# Altium schematic sheet 17 USB 3.0.SchDoc
size C; DocumentNumber: 17; SheetNumber: 17; SheetTotal: 17; PageSetup: Record=PageOptions|CenterHorizontal=True|CenterVertical=True|PrintScale=0.70|XCorrection=1.00|YCorrection=1.00|PrintKind=1|BorderSize=5000000|LeftOffset=0|BottomOffset=0|Orientation=2|PaperLength=1000|PaperWidth=1000|Scale=100|PaperSource=7|PrintQuality=600|MediaType=1|DitherType=10|PrintScaleMode=1|PaperKind=11x17|PaperIndex=17
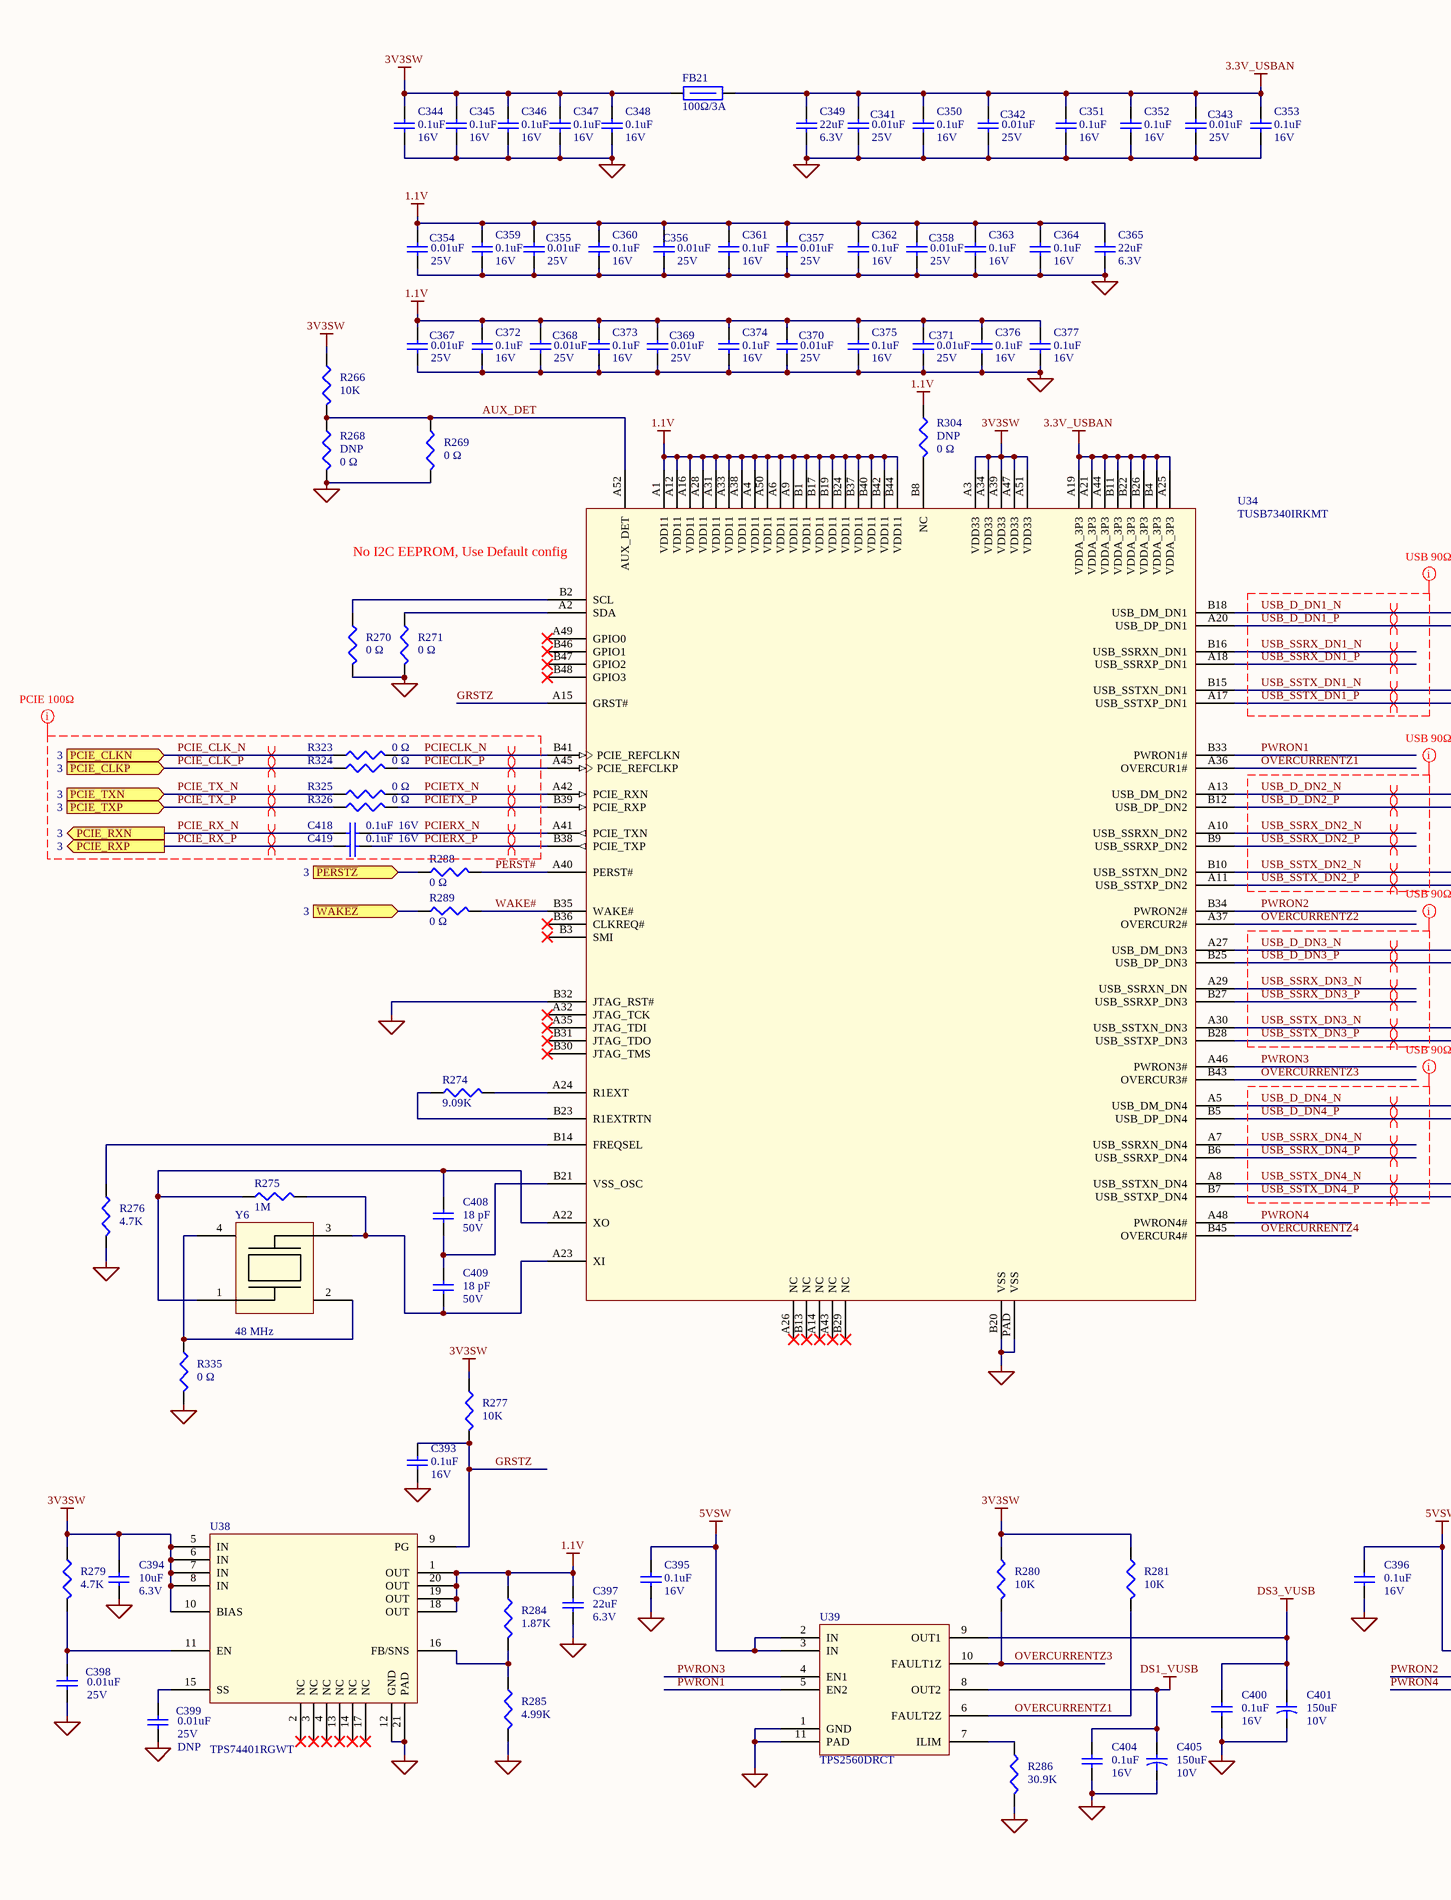
[diagram p0: 17 USB 3.0.SchDoc, left]
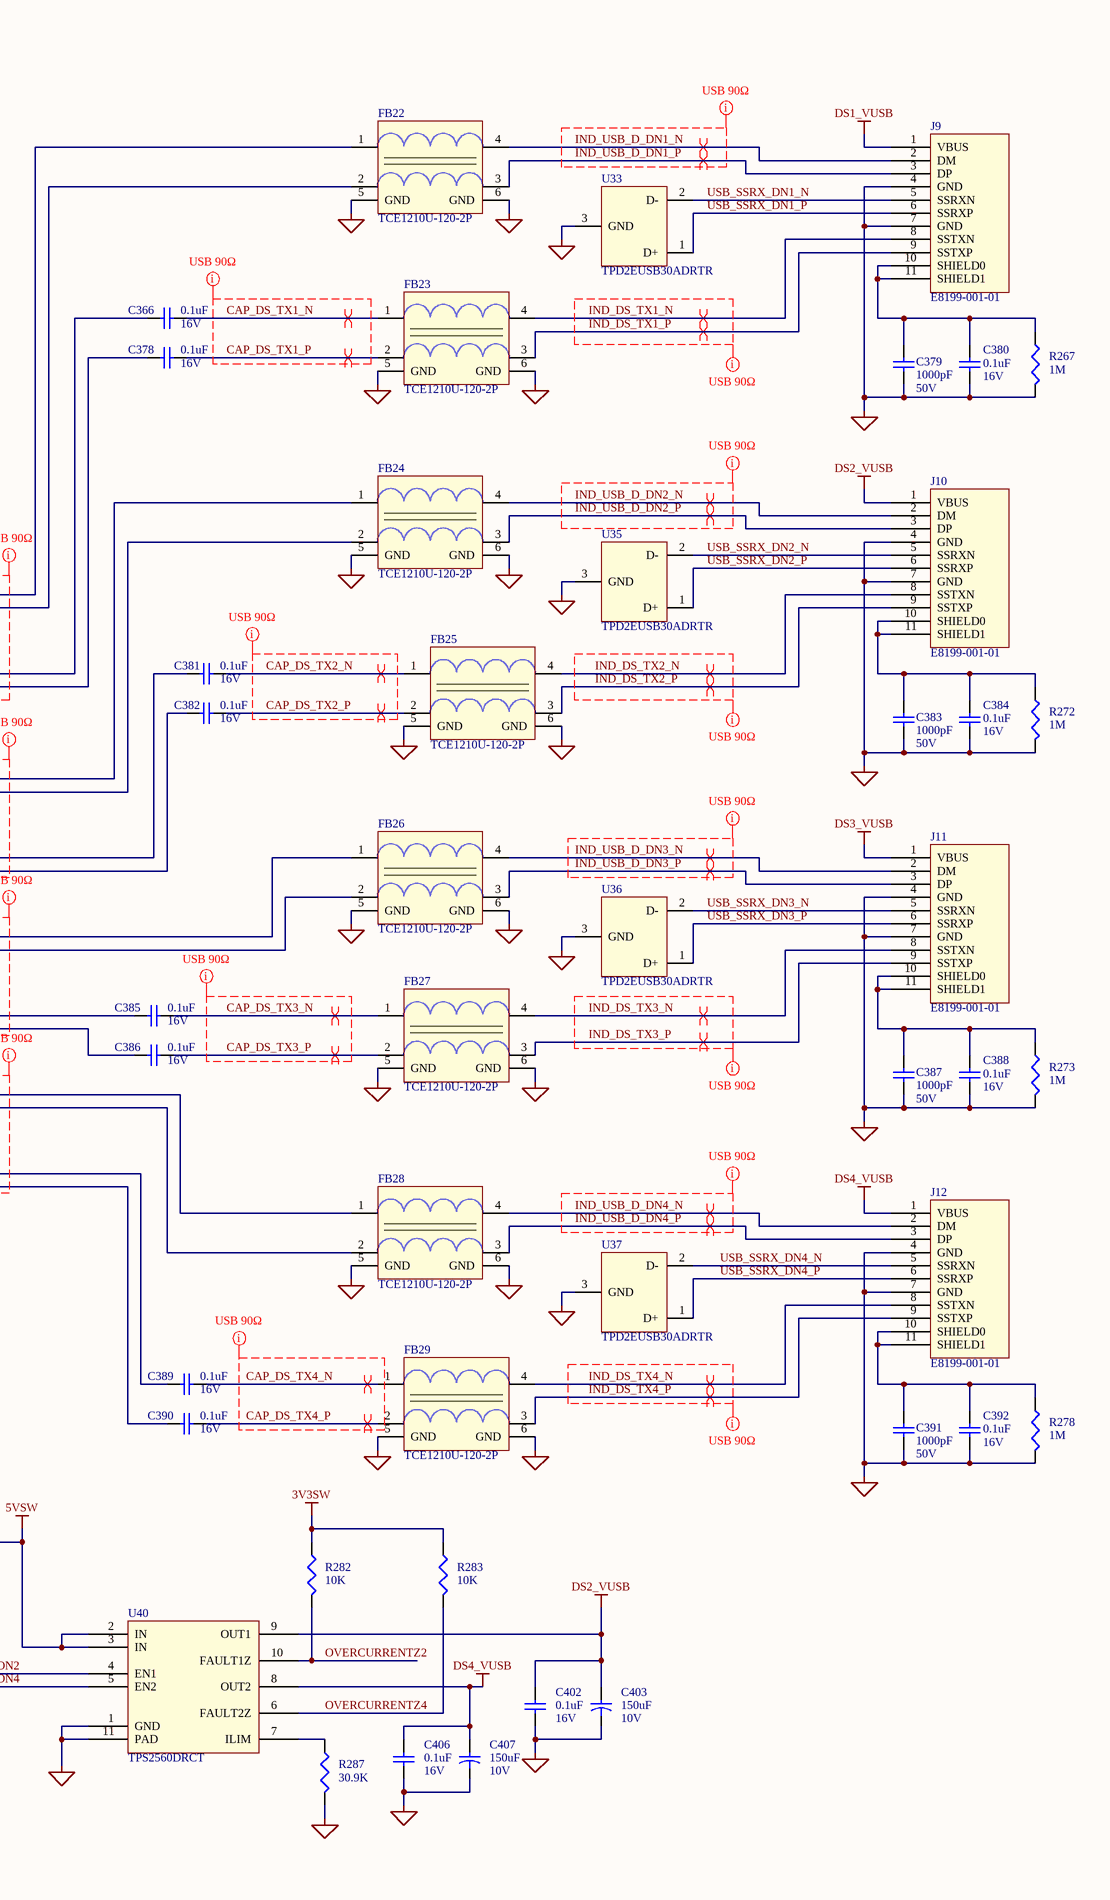
[diagram p1: 17 USB 3.0.SchDoc, right]

## Parts
C341  value 0.01uF  Voltage: 25V  [CAP_0402]  (hidden comment: Cap 0.01uF 50V 0402)
C342  value 0.01uF  Voltage: 25V  [CAP_0402]  (hidden comment: Cap 0.01uF 50V 0402)
C343  value 0.01uF  Voltage: 25V  [CAP_0402]  (hidden comment: Cap 0.01uF 50V 0402)
C344  value 0.1uF  Voltage: 16V  [CAP_0402]  (hidden comment: Cap 0.1uF 16V 0402)
C345  value 0.1uF  Voltage: 16V  [CAP_0402]  (hidden comment: Cap 0.1uF 16V 0402)
C346  value 0.1uF  Voltage: 16V  [CAP_0402]  (hidden comment: Cap 0.1uF 16V 0402)
C347  value 0.1uF  Voltage: 16V  [CAP_0402]  (hidden comment: Cap 0.1uF 16V 0402)
C348  value 0.1uF  Voltage: 16V  [CAP_0402]  (hidden comment: Cap 0.1uF 16V 0402)
C349  value 22uF  Voltage: 6.3V  [CAP_0603]  (hidden comment: Cap 22uF 6.3V 0603)
C350  value 0.1uF  Voltage: 16V  [CAP_0402]  (hidden comment: Cap 0.1uF 16V 0402)
C351  value 0.1uF  Voltage: 16V  [CAP_0402]  (hidden comment: Cap 0.1uF 16V 0402)
C352  value 0.1uF  Voltage: 16V  [CAP_0402]  (hidden comment: Cap 0.1uF 16V 0402)
C353  value 0.1uF  Voltage: 16V  [CAP_0402]  (hidden comment: Cap 0.1uF 16V 0402)
C354  value 0.01uF  Voltage: 25V  [CAP_0402]  (hidden comment: Cap 0.01uF 50V 0402)
C355  value 0.01uF  Voltage: 25V  [CAP_0402]  (hidden comment: Cap 0.01uF 50V 0402)
C356  value 0.01uF  Voltage: 25V  [CAP_0402]  (hidden comment: Cap 0.01uF 50V 0402)
C357  value 0.01uF  Voltage: 25V  [CAP_0402]  (hidden comment: Cap 0.01uF 50V 0402)
C358  value 0.01uF  Voltage: 25V  [CAP_0402]  (hidden comment: Cap 0.01uF 50V 0402)
C359  value 0.1uF  Voltage: 16V  [CAP_0402]  (hidden comment: Cap 0.1uF 16V 0402)
C360  value 0.1uF  Voltage: 16V  [CAP_0402]  (hidden comment: Cap 0.1uF 16V 0402)
C361  value 0.1uF  Voltage: 16V  [CAP_0402]  (hidden comment: Cap 0.1uF 16V 0402)
C362  value 0.1uF  Voltage: 16V  [CAP_0402]  (hidden comment: Cap 0.1uF 16V 0402)
C363  value 0.1uF  Voltage: 16V  [CAP_0402]  (hidden comment: Cap 0.1uF 16V 0402)
C364  value 0.1uF  Voltage: 16V  [CAP_0402]  (hidden comment: Cap 0.1uF 16V 0402)
C365  value 22uF  Voltage: 6.3V  [CAP_0603]  (hidden comment: Cap 22uF 6.3V 0603)
C366  value 0.1uF  Voltage: 16V  [CAP_0402]  (hidden comment: Cap 0.1uF 16V 0402)
C367  value 0.01uF  Voltage: 25V  [CAP_0402]  (hidden comment: Cap 0.01uF 50V 0402)
C368  value 0.01uF  Voltage: 25V  [CAP_0402]  (hidden comment: Cap 0.01uF 50V 0402)
C369  value 0.01uF  Voltage: 25V  [CAP_0402]  (hidden comment: Cap 0.01uF 50V 0402)
C370  value 0.01uF  Voltage: 25V  [CAP_0402]  (hidden comment: Cap 0.01uF 50V 0402)
C371  value 0.01uF  Voltage: 25V  [CAP_0402]  (hidden comment: Cap 0.01uF 50V 0402)
C372  value 0.1uF  Voltage: 16V  [CAP_0402]  (hidden comment: Cap 0.1uF 16V 0402)
C373  value 0.1uF  Voltage: 16V  [CAP_0402]  (hidden comment: Cap 0.1uF 16V 0402)
C374  value 0.1uF  Voltage: 16V  [CAP_0402]  (hidden comment: Cap 0.1uF 16V 0402)
C375  value 0.1uF  Voltage: 16V  [CAP_0402]  (hidden comment: Cap 0.1uF 16V 0402)
C376  value 0.1uF  Voltage: 16V  [CAP_0402]  (hidden comment: Cap 0.1uF 16V 0402)
C377  value 0.1uF  Voltage: 16V  [CAP_0402]  (hidden comment: Cap 0.1uF 16V 0402)
C378  value 0.1uF  Voltage: 16V  [CAP_0402]  (hidden comment: Cap 0.1uF 16V 0402)
C379  value 1000pF  Voltage: 50V  [CAP_0402]  (hidden comment: Cap 1000pF 50V 0402)
C380  value 0.1uF  Voltage: 16V  [CAP_0402]  (hidden comment: Cap 0.1uF 16V 0402)
C381  value 0.1uF  Voltage: 16V  [CAP_0402]  (hidden comment: Cap 0.1uF 16V 0402)
C382  value 0.1uF  Voltage: 16V  [CAP_0402]  (hidden comment: Cap 0.1uF 16V 0402)
C383  value 1000pF  Voltage: 50V  [CAP_0402]  (hidden comment: Cap 1000pF 50V 0402)
C384  value 0.1uF  Voltage: 16V  [CAP_0402]  (hidden comment: Cap 0.1uF 16V 0402)
C385  value 0.1uF  Voltage: 16V  [CAP_0402]  (hidden comment: Cap 0.1uF 16V 0402)
C386  value 0.1uF  Voltage: 16V  [CAP_0402]  (hidden comment: Cap 0.1uF 16V 0402)
C387  value 1000pF  Voltage: 50V  [CAP_0402]  (hidden comment: Cap 1000pF 50V 0402)
C388  value 0.1uF  Voltage: 16V  [CAP_0402]  (hidden comment: Cap 0.1uF 16V 0402)
C389  value 0.1uF  Voltage: 16V  [CAP_0402]  (hidden comment: Cap 0.1uF 16V 0402)
C390  value 0.1uF  Voltage: 16V  [CAP_0402]  (hidden comment: Cap 0.1uF 16V 0402)
C391  value 1000pF  Voltage: 50V  [CAP_0402]  (hidden comment: Cap 1000pF 50V 0402)
C392  value 0.1uF  Voltage: 16V  [CAP_0402]  (hidden comment: Cap 0.1uF 16V 0402)
C393  value 0.1uF  Voltage: 16V  [CAP_0402]  (hidden comment: Cap 0.1uF 16V 0402)
C394  value 10uF  Voltage: 6.3V  [CAP_0402]  (hidden comment: Cap 10uF 6.3V 0402)
C395  value 0.1uF  Voltage: 16V  [CAP_0402]  (hidden comment: Cap 0.1uF 16V 0402)
C396  value 0.1uF  Voltage: 16V  [CAP_0402]  (hidden comment: Cap 0.1uF 16V 0402)
C397  value 22uF  Voltage: 6.3V  [CAP_0603]  (hidden comment: Cap 22uF 6.3V 0603)
C398  value 0.01uF  Voltage: 25V  [CAP_0402]  (hidden comment: Cap 0.01uF 50V 0402)
C399  value 0.01uF  Voltage: 25V  [CAP_0402]  (hidden comment: Cap 0.01uF 50V 0402)
C400  value 0.1uF  Voltage: 16V  [CAP_0402]  (hidden comment: Cap 0.1uF 16V 0402)
C401  value 150uF  Voltage: 10V  [SMD(6.6x6.6x5.8)_WT1A151MCL1GS]  (hidden comment: Cap 150uF 10V)
C402  value 0.1uF  Voltage: 16V  [CAP_0402]  (hidden comment: Cap 0.1uF 16V 0402)
C403  value 150uF  Voltage: 10V  [SMD(6.6x6.6x5.8)_WT1A151MCL1GS]  (hidden comment: Cap 150uF 10V)
C404  value 0.1uF  Voltage: 16V  [CAP_0402]  (hidden comment: Cap 0.1uF 16V 0402)
C405  value 150uF  Voltage: 10V  [SMD(6.6x6.6x5.8)_WT1A151MCL1GS]  (hidden comment: Cap 150uF 10V)
C406  value 0.1uF  Voltage: 16V  [CAP_0402]  (hidden comment: Cap 0.1uF 16V 0402)
C407  value 150uF  Voltage: 10V  [SMD(6.6x6.6x5.8)_WT1A151MCL1GS]  (hidden comment: Cap 150uF 10V)
C408  value 18 pF  Voltage: 50V  [CAP_0402]  (hidden comment: Cap 18pF 50V 0402)
C409  value 18 pF  Voltage: 50V  [CAP_0402]  (hidden comment: Cap 18pF 50V 0402)
C418  value 0.1uF  Voltage: 16V  [CAP_0402]  (hidden comment: Cap 0.1uF 16V 0402)
C419  value 0.1uF  Voltage: 16V  [CAP_0402]  (hidden comment: Cap 0.1uF 16V 0402)
FB21  value 100Ω/3A  [IND_0603]  (hidden comment: BLM18KG101TN1D)
FB22  TCE1210U-120-2P  [USB_TCE1210U-120-2P]
FB23  TCE1210U-120-2P  [USB_TCE1210U-120-2P]
FB24  TCE1210U-120-2P  [USB_TCE1210U-120-2P]
FB25  TCE1210U-120-2P  [USB_TCE1210U-120-2P]
FB26  TCE1210U-120-2P  [USB_TCE1210U-120-2P]
FB27  TCE1210U-120-2P  [USB_TCE1210U-120-2P]
FB28  TCE1210U-120-2P  [USB_TCE1210U-120-2P]
FB29  TCE1210U-120-2P  [USB_TCE1210U-120-2P]
J9  E8199-001-01  [USB_E8199-001-01]
J10  E8199-001-01  [USB_E8199-001-01]
J11  E8199-001-01  [USB_E8199-001-01]
J12  E8199-001-01  [USB_E8199-001-01]
R266  value 10K  [RES_0402]  (hidden comment: Res 10K 0.063W)
R267  value 1M  [RES_0402]  (hidden comment: Res 1M 0.063W)
R268  value 0 Ω  [RES_0402]  (hidden comment: Res 0 ohm 0.1W DNP)
R269  value 0 Ω  [RES_0402]  (hidden comment: Res 0 ohm 0.1W)
R270  value 0 Ω  [RES_0402]  (hidden comment: Res 0 ohm 0.1W)
R271  value 0 Ω  [RES_0402]  (hidden comment: Res 0 ohm 0.1W)
R272  value 1M  [RES_0402]  (hidden comment: Res 1M 0.063W)
R273  value 1M  [RES_0402]  (hidden comment: Res 1M 0.063W)
R274  value 9.09K  [RES_0402]  (hidden comment: Res 9.09K 0.063W)
R275  value 1M  [RES_0402]  (hidden comment: Res 1M 0.063W)
R276  value 4.7K  [RES_0402]  (hidden comment: Res 4.7K 0.063W)
R277  value 10K  [RES_0402]  (hidden comment: Res 10K 0.063W)
R278  value 1M  [RES_0402]  (hidden comment: Res 1M 0.063W)
R279  value 4.7K  [RES_0402]  (hidden comment: Res 4.7K 0.063W)
R280  value 10K  [RES_0402]  (hidden comment: Res 10K 0.063W)
R281  value 10K  [RES_0402]  (hidden comment: Res 10K 0.063W)
R282  value 10K  [RES_0402]  (hidden comment: Res 10K 0.063W)
R283  value 10K  [RES_0402]  (hidden comment: Res 10K 0.063W)
R284  value 1.87K  [RES_0402]  (hidden comment: Res 1.87K 0.063W)
R285  value 4.99K  [RES_0402]  (hidden comment: Res 4.99K 0.063W)
R286  value 30.9K  [RES_0402]  (hidden comment: Res 30.9K 0.063W)
R287  value 30.9K  [RES_0402]  (hidden comment: Res 30.9K 0.063W)
R288  value 0 Ω  [RES_0402]  (hidden comment: Res 0 ohm 0.1W)
R289  value 0 Ω  [RES_0402]  (hidden comment: Res 0 ohm 0.1W)
R304  value 0 Ω  [RES_0402]  (hidden comment: Res 0 ohm 0.1W DNP)
R323  value 0 Ω  [RES_0402]  (hidden comment: Res 0 ohm 0.1W)
R324  value 0 Ω  [RES_0402]  (hidden comment: Res 0 ohm 0.1W)
R325  value 0 Ω  [RES_0402]  (hidden comment: Res 0 ohm 0.1W)
R326  value 0 Ω  [RES_0402]  (hidden comment: Res 0 ohm 0.1W)
R335  value 0 Ω  [RES_0402]  (hidden comment: Res 0 ohm 0.1W)
U33  TPD2EUSB30ADRTR  [SOT-3_TPD2EUSB30ADRTR]
U34  TUSB7340IRKMT  [WQFN-100_TUSB7340]
U35  TPD2EUSB30ADRTR  [SOT-3_TPD2EUSB30ADRTR]
U36  TPD2EUSB30ADRTR  [SOT-3_TPD2EUSB30ADRTR]
U37  TPD2EUSB30ADRTR  [SOT-3_TPD2EUSB30ADRTR]
U38  TPS74401RGWT  [VQFN-20_TPS74401RGWT]
U39  TPS2560DRCT  [VSON-10_TPS2560DRCT]
U40  TPS2560DRCT  [VSON-10_TPS2560DRCT]
Y6  value 48 MHz  [SMD(5x3.2)_ABM3B-48.000MHZ-B2-T]  (hidden comment: ABM3B-48.000MHZ-B2-T)

## Ports
PCIE_CLKN (in, see 3), PCIE_CLKP (in, see 3), PCIE_RXN (out, see 3), PCIE_RXP (out, see 3), PCIE_TXN (in, see 3), PCIE_TXP (in, see 3), ~{PERSTZ} (in, see 3), ~{WAKEZ} (in, see 3)

## Nets
1.1V: C354.1 C355.1 C356.1 C357.1 C358.1 C359.1 C360.1 C361.1 C362.1 C363.1 C364.1 C365.1 C367.1 C368.1 C369.1 C370.1 C371.1 C372.1 C373.1 C374.1 C375.1 C376.1 C377.1 C397.1 R284.1 R304.1 U34.A1(VDD11) U34.A4(VDD11) U34.A6(VDD11) U34.A9(VDD11) U34.A12(VDD11) U34.A16(VDD11) U34.A28(VDD11) U34.A31(VDD11) U34.A33(VDD11) U34.A38(VDD11) U34.A50(VDD11) U34.B1(VDD11) U34.B17(VDD11) U34.B19(VDD11) U34.B24(VDD11) U34.B37(VDD11) U34.B40(VDD11) U34.B42(VDD11) U34.B44(VDD11) U38.1(OUT) U38.18(OUT) U38.19(OUT) U38.20(OUT)
3.3V_USBAN: C341.1 C342.1 C343.1 C349.1 C350.1 C351.1 C352.1 C353.1 FB21.2 U34.A19(VDDA_3P3) U34.A21(VDDA_3P3) U34.A25(VDDA_3P3) U34.A44(VDDA_3P3) U34.B4(VDDA_3P3) U34.B11(VDDA_3P3) U34.B22(VDDA_3P3) U34.B26(VDDA_3P3)
3V3SW: C344.1 C345.1 C346.1 C347.1 C348.1 C394.1 FB21.1 R266.1 R277.1 R279.1 R280.1 R281.1 R282.1 R283.1 U34.A3(VDD33) U34.A34(VDD33) U34.A39(VDD33) U34.A47(VDD33) U34.A51(VDD33) U38.5(IN) U38.6(IN) U38.7(IN) U38.8(IN) U38.10(BIAS)
5VSW: C395.1 C396.2 U39.2(IN) U39.3(IN) U40.2(IN) U40.3(IN)
DS1_VUSB: C404.1 C405.1 J9.1(VBUS) U39.8(OUT2)
DS2_VUSB: C402.1 C403.1 J10.1(VBUS) U40.9(OUT1)
DS3_VUSB: C400.1 C401.1 J11.1(VBUS) U39.9(OUT1)
DS4_VUSB: C406.1 C407.1 J12.1(VBUS) U40.8(OUT2)
GND: C341.2 C342.2 C343.2 C344.2 C345.2 C346.2 C347.2 C348.2 C349.2 C350.2 C351.2 C352.2 C353.2 C354.2 C355.2 C356.2 C357.2 C358.2 C359.2 C360.2 C361.2 C362.2 C363.2 C364.2 C365.2 C367.2 C368.2 C369.2 C370.2 C371.2 C372.2 C373.2 C374.2 C375.2 C376.2 C377.2 C379.2 C380.2 C383.2 C384.2 C387.2 C388.2 C391.2 C392.2 C393.2 C394.2 C395.2 C396.1 C397.2 C398.2 C399.2 C400.2 C401.2 C402.2 C403.2 C404.2 C405.2 C406.2 C407.2 FB22.5(GND) FB22.6(GND) FB23.5(GND) FB23.6(GND) FB24.5(GND) FB24.6(GND) FB25.5(GND) FB25.6(GND) FB26.5(GND) FB26.6(GND) FB27.5(GND) FB27.6(GND) FB28.5(GND) FB28.6(GND) FB29.5(GND) FB29.6(GND) J9.4(GND) J9.7(GND) J10.4(GND) J10.7(GND) J11.4(GND) J11.7(GND) J12.4(GND) J12.7(GND) R267.2 R268.2 R269.2 R270.2 R271.2 R272.2 R273.2 R276.2 R278.2 R285.2 R286.2 R287.2 R335.2 U33.3(GND) U34.B20(VSS) U34.B32(JTAG_RST#) U34.PAD(VSS) U35.3(GND) U36.3(GND) U37.3(GND) U38.12(GND) U38.21(PAD) U39.1(GND) U39.11(PAD) U40.1(GND) U40.11(PAD)
AUX_DET: R266.2 R268.1 R269.1 U34.A52(AUX_DET)
CAP_DS_TX1_N: C366.2 FB23.1
CAP_DS_TX1_P: C378.2 FB23.2
CAP_DS_TX2_N: C381.2 FB25.1
CAP_DS_TX2_P: C382.2 FB25.2
CAP_DS_TX3_N: C385.2 FB27.1
CAP_DS_TX3_P: C386.2 FB27.2
CAP_DS_TX4_N: C389.2 FB29.1
CAP_DS_TX4_P: C390.2 FB29.2
GRSTZ: C393.1 R277.2 U34.A15(GRST#) U38.9(PG)
IND_DS_TX1_N: FB23.4 J9.8(SSTXN)
IND_DS_TX1_P: FB23.3 J9.9(SSTXP)
IND_DS_TX2_N: FB25.4 J10.8(SSTXN)
IND_DS_TX2_P: FB25.3 J10.9(SSTXP)
IND_DS_TX3_N: FB27.4 J11.8(SSTXN)
IND_DS_TX3_P: FB27.3 J11.9(SSTXP)
IND_DS_TX4_N: FB29.4 J12.8(SSTXN)
IND_DS_TX4_P: FB29.3 J12.9(SSTXP)
IND_USB_D_DN1_N: FB22.4 J9.2(DM)
IND_USB_D_DN1_P: FB22.3 J9.3(DP)
IND_USB_D_DN2_N: FB24.4 J10.2(DM)
IND_USB_D_DN2_P: FB24.3 J10.3(DP)
IND_USB_D_DN3_N: FB26.4 J11.2(DM)
IND_USB_D_DN3_P: FB26.3 J11.3(DP)
IND_USB_D_DN4_N: FB28.4 J12.2(DM)
IND_USB_D_DN4_P: FB28.3 J12.3(DP)
OVERCURRENTZ1: R281.2 U34.A36(OVERCUR1#) U39.6(FAULT2Z)
OVERCURRENTZ2: R282.2 U34.A37(OVERCUR2#) U40.10(FAULT1Z)
OVERCURRENTZ3: R280.2 U34.B43(OVERCUR3#) U39.10(FAULT1Z)
OVERCURRENTZ4: R283.2 U34.B45(OVERCUR4#) U40.6(FAULT2Z)
~{PERSTZ}: R288.1 ; port ~{PERSTZ}
PCIE_CLK_N: R323.1 ; port PCIE_CLKN
PCIE_CLK_P: R324.1 ; port PCIE_CLKP
PCIE_RX_N: C418.1 ; port PCIE_RXN
PCIE_RX_P: C419.1 ; port PCIE_RXP
PCIE_TX_N: R325.1 ; port PCIE_TXN
PCIE_TX_P: R326.1 ; port PCIE_TXP
PCIECLK_N: R323.2 U34.B41(PCIE_REFCLKN)
PCIECLK_P: R324.2 U34.A45(PCIE_REFCLKP)
PCIERX_N: C418.2 U34.A41(PCIE_TXN)
PCIERX_P: C419.2 U34.B38(PCIE_TXP)
PCIETX_N: R325.2 U34.A42(PCIE_RXN)
PCIETX_P: R326.2 U34.B39(PCIE_RXP)
PERST#: R288.2 U34.A40(PERST#)
PWRON1: U34.B33(PWRON1#) U39.5(EN2)
PWRON2: U34.B34(PWRON2#) U40.4(EN1)
PWRON3: U34.A46(PWRON3#) U39.4(EN1)
PWRON4: U34.A48(PWRON4#) U40.5(EN2)
USB_D_DN1_N: FB22.1 U34.B18(USB_DM_DN1)
USB_D_DN1_P: FB22.2 U34.A20(USB_DP_DN1)
USB_D_DN2_N: FB24.1 U34.A13(USB_DM_DN2)
USB_D_DN2_P: FB24.2 U34.B12(USB_DP_DN2)
USB_D_DN3_N: FB26.1 U34.A27(USB_DM_DN3)
USB_D_DN3_P: FB26.2 U34.B25(USB_DP_DN3)
USB_D_DN4_N: FB28.1 U34.A5(USB_DM_DN4)
USB_D_DN4_P: FB28.2 U34.B5(USB_DP_DN4)
USB_SSRX_DN1_N: J9.5(SSRXN) U33.2(D-) U34.B16(USB_SSRXN_DN1)
USB_SSRX_DN1_P: J9.6(SSRXP) U33.1(D+) U34.A18(USB_SSRXP_DN1)
USB_SSRX_DN2_N: J10.5(SSRXN) U34.A10(USB_SSRXN_DN2) U35.2(D-)
USB_SSRX_DN2_P: J10.6(SSRXP) U34.B9(USB_SSRXP_DN2) U35.1(D+)
USB_SSRX_DN3_N: J11.5(SSRXN) U34.A29(USB_SSRXN_DN) U36.2(D-)
USB_SSRX_DN3_P: J11.6(SSRXP) U34.B27(USB_SSRXP_DN3) U36.1(D+)
USB_SSRX_DN4_N: J12.5(SSRXN) U34.A7(USB_SSRXN_DN4) U37.2(D-)
USB_SSRX_DN4_P: J12.6(SSRXP) U34.B6(USB_SSRXP_DN4) U37.1(D+)
USB_SSTX_DN1_N: C366.1 U34.B15(USB_SSTXN_DN1)
USB_SSTX_DN1_P: C378.1 U34.A17(USB_SSTXP_DN1)
USB_SSTX_DN2_N: C381.1 U34.B10(USB_SSTXN_DN2)
USB_SSTX_DN2_P: C382.1 U34.A11(USB_SSTXP_DN2)
USB_SSTX_DN3_N: C385.1 U34.A30(USB_SSTXN_DN3)
USB_SSTX_DN3_P: C386.1 U34.B28(USB_SSTXP_DN3)
USB_SSTX_DN4_N: C389.1 U34.A8(USB_SSTXN_DN4)
USB_SSTX_DN4_P: C390.1 U34.B7(USB_SSTXP_DN4)
~{WAKEZ}: R289.1 ; port ~{WAKEZ}
WAKE#: R289.2 U34.B35(WAKE#)
NetC379_1: C379.1 C380.1 J9.10(SHIELD0) J9.11(SHIELD1) R267.1
NetC383_1: C383.1 C384.1 J10.10(SHIELD0) J10.11(SHIELD1) R272.1
NetC387_1: C387.1 C388.1 J11.10(SHIELD0) J11.11(SHIELD1) R273.1
NetC391_1: C391.1 C392.1 J12.10(SHIELD0) J12.11(SHIELD1) R278.1
NetC398_1: C398.1 R279.2 U38.11(EN)
NetC399_1: C399.1 U38.15(SS)
NetC408_1: C408.1 C409.2 U34.B21(VSS_OSC)
NetC408_2: C408.2 R275.1 U34.A22(XO) Y6.1
NetC409_1: C409.1 R275.2 U34.A23(XI) Y6.3
NetR270_1: R270.1 U34.B2(SCL)
NetR271_1: R271.1 U34.A2(SDA)
NetR274_1: R274.1 U34.B23(R1EXTRTN)
NetR274_2: R274.2 U34.A24(R1EXT)
NetR276_1: R276.1 U34.B14(FREQSEL)
NetR284_2: R284.2 R285.1 U38.16(FB/SNS)
NetR286_1: R286.1 U39.7(ILIM)
NetR287_1: R287.1 U40.7(ILIM)
NetR304_2: R304.2 U34.B8(NC)
NetR335_1: R335.1 Y6.2 Y6.4

Not connected (* = marked no-connect by the designer): U34 A14(NC)* A26(NC)* A32(JTAG_TCK)* A35(JTAG_TDI)* A43(NC)* A49(GPIO0)* B3(SMI)* B13(NC)* B29(NC)* B30(JTAG_TMS)* B31(JTAG_TDO)* B36(CLKREQ#)* B46(GPIO1)* B47(GPIO2)* B48(GPIO3)*; U38 2(NC)* 3(NC)* 4(NC)* 13(NC)* 14(NC)* 17(NC)*

## Layout directives
net class USB 90ohm; Impedance: 90 Ω: CAP_DS_TX1_N, CAP_DS_TX1_P, CAP_DS_TX2_N, CAP_DS_TX2_P, CAP_DS_TX3_N, CAP_DS_TX3_P, CAP_DS_TX4_N, CAP_DS_TX4_P, IND_DS_TX1_N, IND_DS_TX1_P, IND_DS_TX2_N, IND_DS_TX2_P, IND_DS_TX3_N, IND_DS_TX3_P, IND_DS_TX4_N, IND_DS_TX4_P, IND_USB_D_DN1_N, IND_USB_D_DN1_P, IND_USB_D_DN2_N, IND_USB_D_DN2_P, IND_USB_D_DN3_N, IND_USB_D_DN3_P, IND_USB_D_DN4_N, IND_USB_D_DN4_P, USB_D_DN1_N, USB_D_DN1_P, USB_D_DN2_N, USB_D_DN2_P, USB_D_DN3_N, USB_D_DN3_P, USB_D_DN4_N, USB_D_DN4_P, USB_SSRX_DN1_N, USB_SSRX_DN1_P, USB_SSRX_DN2_N, USB_SSRX_DN2_P, USB_SSRX_DN3_N, USB_SSRX_DN3_P, USB_SSRX_DN4_N, USB_SSRX_DN4_P, USB_SSTX_DN1_N, USB_SSTX_DN1_P, USB_SSTX_DN2_N, USB_SSTX_DN2_P, USB_SSTX_DN3_N, USB_SSTX_DN3_P, USB_SSTX_DN4_N, USB_SSTX_DN4_P
differential pair: CAP_DS_TX1_N, CAP_DS_TX1_P, CAP_DS_TX2_N, CAP_DS_TX2_P, CAP_DS_TX3_N, CAP_DS_TX3_P, CAP_DS_TX4_N, CAP_DS_TX4_P, IND_DS_TX1_N, IND_DS_TX1_P, IND_DS_TX2_N, IND_DS_TX2_P, IND_DS_TX3_N, IND_DS_TX3_P, IND_DS_TX4_N, IND_DS_TX4_P, IND_USB_D_DN1_N, IND_USB_D_DN1_P, IND_USB_D_DN2_N, IND_USB_D_DN2_P, IND_USB_D_DN3_N, IND_USB_D_DN3_P, IND_USB_D_DN4_N, IND_USB_D_DN4_P, PCIE_CLK_N, PCIE_CLK_P, PCIE_RX_N, PCIE_RX_P, PCIE_TX_N, PCIE_TX_P, PCIECLK_N, PCIECLK_P, PCIERX_N, PCIERX_P, PCIETX_N, PCIETX_P, USB_D_DN1_N, USB_D_DN1_P, USB_D_DN2_N, USB_D_DN2_P, USB_D_DN3_N, USB_D_DN3_P, USB_D_DN4_N, USB_D_DN4_P, USB_SSRX_DN1_N, USB_SSRX_DN1_P, USB_SSRX_DN2_N, USB_SSRX_DN2_P, USB_SSRX_DN3_N, USB_SSRX_DN3_P, USB_SSRX_DN4_N, USB_SSRX_DN4_P, USB_SSTX_DN1_N, USB_SSTX_DN1_P, USB_SSTX_DN2_N, USB_SSTX_DN2_P, USB_SSTX_DN3_N, USB_SSTX_DN3_P, USB_SSTX_DN4_N, USB_SSTX_DN4_P
net class PCIE 100ohm: PCIE_CLK_N, PCIE_CLK_P, PCIE_RX_N, PCIE_RX_P, PCIE_TX_N, PCIE_TX_P, PCIECLK_N, PCIECLK_P, PCIERX_N, PCIERX_P, PCIETX_N, PCIETX_P

## Notes on the sheet
- (near U34) No I2C EEPROM, Use Default config
- First View Consultants
- Austin, Tx
- 512.582.9102
- firstviewconsultants.com
- Title:
- File:
- Drawn:
- Sheet
- of
- FVC #:
- Checked:
- Approved:
- Date:
- Page Size:
- C
- Rev.
- Time:

## Library data of the parts
C341-C343 C354-C358 C367-C371 C398 C399 = Cap 0.01uF 50V 0402: Cap, Cer, 0.01uF, 25V, ±10%, X7R, 0402; Manufacturer #: GRM155R71E103KA01J; Manufacturer: Murata; Have Footprint: yes; Tolerance: ±10%; Package: 0402
  C399: DNP: DNP
C344-C348 C350-C353 C359-C364 C366 C372-C378 C380-C382 C384-C386 C388-C390 C392 C393 C395 C396 C400 C402 C404 C406 C418 C419 = Cap 0.1uF 16V 0402: Cap, Cer, 0.1uF, 16V, 10%, X7R, 0402; Manufacturer #: GRM155R71C104KA88D; Manufacturer: Murata Electronics North America; Have Footprint: yes; Package: 0402; Tolerance: ±10%
C349 C365 C397 = Cap 22uF 6.3V 0603: Cap, Cer, 22uF, 6.3V, 20%, X5R, 0603; Manufacturer: Murata Electronics North America; Manufacturer #: GRM188R60J226MEA0D; Tolerance: ±10%; Package: 0603; Temperature Coefficient: X5R; Cost: $0.27
C379 C383 C387 C391 = Cap 1000pF 50V 0402: Cap, Cer, 1000pF, 50V, 20%, X7R, 0402; Manufacturer: Murata Electronics North America; Manufacturer #: GRM155R71H102KA01D; Have Footprint: yes; Tolerance: 20%; PACKAGE: 0402
C394 = Cap 10uF 6.3V 0402: Cap, Cer, 10uF, 6.3V, 20%, X5R, 0402; Manufacturer #: CL05A106MQ5NUNC; Manufacturer: Samsung Electro-Mechanics America, Inc; Have Footprint: yes; RoHS: yes; Tolerance: ±20%; Operating Temperature: -55°C ~ 85°C; Package: 0402
C401 C403 C405 C407 = Cap 150uF 10V: Cap, Alum, 150µF, 10V, 20%, SMD; Manufacturer #: WT1A151MCL1GS; Manufacturer: Nichicon; Tolerance: 20%; Package: SMD (6.6x6.6x5.8); Operating Temperature: -55°C ~ 105°C
C408 C409 = Cap 18pF 50V 0402: Cap, Cer, 18pF, 50V, 5%, C0G, 0402; Manufacturer #: C1005C0G1H180J050BA; Manufacturer: TDK Corporation; Have Footprint: yes; Package: 0402
FB21 = BLM18KG101TN1D: Ind, Ferrite Bead, 100R, 30mOhm, 3A, 0603; Manufacturer: Murata Electronics North America; Have Footprint: yes; RoHS: yes; Package: 0603; Manufacturer #: BLM18KG101TN1D
FB22-FB29 = TCE1210U-120-2P: Choke, Common Mode, 12 ohm, SMD; Manufacturer: TDK Corporation; Cost: 1.73; Manufacturer #: TCE1210U-120-2P; Package: SMD(1.25x1)
J9-J12 = E8199-001-01: Conn, USB 3.0, TYPE A RCPT, TH; Manufacturer: Pulse Electronics Corporation; Have Footprint: yes; Manufacturer #: E8199-001-01; Cost: 0.73; Package: TH
R266 R277 R280-R283 = Res 10K 0.063W: Res, 10K, 1/16W, 1%, 0402; Manufacturer #: RC0402FR-0710KL; Manufacturer: Yageo; Have Footprint: yes; Package: 0402
R267 R272 R273 R275 R278 = Res 1M 0.063W: Res, 1M, 0.063W, 1%, 0402; Manufacturer #: RC0402FR-071ML; Manufacturer: Yageo; Have Footprint: yes; Package: 0402
R268 R304 = Res 0 ohm 0.1W DNP: Res, 0 ohm, 1/16W, 0402; Manufacturer #: CRCW04020000Z0ED; Manufacturer: Vishay Dale; Have Footprint: yes; Package: 0402; DNP: DNP
R269-R271 R288 R289 R323-R326 R335 = Res 0 ohm 0.1W: Res, 0 ohm, 1/16W, 0402; Manufacturer #: CRCW04020000Z0ED; Manufacturer: Vishay Dale; Have Footprint: yes; Package: 0402
R274 = Res 9.09K 0.063W: Res, 9.09K, 0.063W, 1%, 0402; Manufacturer #: RMCF0402FT9K09; Manufacturer: Stackpole Electronics Inc; Have Footprint: yes; Package: 0402
R276 R279 = Res 4.7K 0.063W: Res, 4.70K, 0.063W, 1%, 0402; Manufacturer #: CRCW04024K70FKED; Manufacturer: Vishay Dale; Have Footprint: yes; Package: 0402
R284 = Res 1.87K 0.063W: Res, 1.87K, 0.063W, 1%, 0402; Manufacturer #: RMCF0402FT1K87; Manufacturer: Stackpole Electronics Inc; Have Footprint: yes; Package: 0402; Tolerance: 1%
R285 = Res 4.99K 0.063W: Res, 4.99K, 0.063W, 1%, 0402; Manufacturer #: RC1005F4991CS; Manufacturer: Samsung Electro-Mechanics America, Inc; Have Footprint: yes; Package: 0402
R286 R287 = Res 30.9K 0.063W: Res, 30.9K, 0.063W, 1%, 0402; Manufacturer #: RMCF0402FT30K9; Manufacturer: Stackpole Electronics Inc; Have Footprint: yes; Package: 0402
U33 U35-U37 = TPD2EUSB30ADRTR: Diode, TVS, 3.6VWM, 8VC, SOT-3; Manufacturer: Texas Instruments; Cost: 0.61; Manufacturer #: TPD2EUSB30ADRTR
U34 = TUSB7340IRKMT: IC, 4-PORT USB 3.0 xHCI Host HUB, WQFN-100; Manufacturer: Texas Instruments; Cost: 11.14; Manufacturer #: TUSB7340IRKMT; Package: WQFN-100
U38 = TPS74401RGWT: LDO, Adj., 3A, VQFN-20; Manufacturer: Texas Instruments; Have Footprint: yes; Cost: 7.20; Manufacturer #: TPS74401RGWT; Package: VQFN-20
U39 = TPS2560DRC: IC, Power Dist Switch, Adj., VSON-10; Manufacturer: Texas Instruments; Have Footprint: yes; Cost: 3.02; Manufacturer #: TPS2560DRCT; Package: VSON-10
U40 = TPS2560DRCT: IC, Power Dist Switch, Adj., VSON-10; Manufacturer: Texas Instruments; Have Footprint: yes; Cost: 3.02; Manufacturer #: TPS2560DRCT; Package: VSON-10
Y6 = ABM3B-48.000MHZ-B2-T: Clock, Crystal, 48 MHz, 18pF, SMD; Manufacturer: Abracon LLC; Cost: 1.04; Manufacturer #: ABM3B-48.000MHZ-B2-T; Package: SMD(5x3.2)